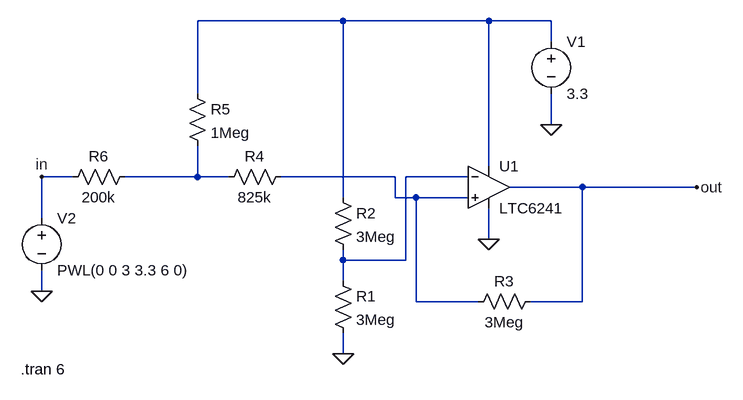
[diagram p0: schematic ENDDET.asc]
ENDDET.asc, the LTspice schematic file:
Version 4
SHEET 1 880 680
WIRE -96 -80 -320 -80
WIRE 128 -80 -96 -80
WIRE 224 -80 128 -80
WIRE 224 -48 224 -80
WIRE -320 32 -320 -80
WIRE 224 80 224 32
WIRE 128 144 128 -80
WIRE -512 160 -560 160
WIRE -320 160 -320 112
WIRE -320 160 -432 160
WIRE -272 160 -320 160
WIRE -16 160 -192 160
WIRE 96 160 0 160
WIRE 272 176 160 176
WIRE 448 176 272 176
WIRE -96 192 -96 -80
WIRE -16 192 -16 160
WIRE 16 192 -16 192
WIRE 96 192 16 192
WIRE -560 224 -560 160
WIRE 128 256 128 208
WIRE -96 288 -96 272
WIRE 0 288 0 160
WIRE 0 288 -96 288
WIRE -96 320 -96 288
WIRE -560 336 -560 304
WIRE 16 352 16 192
WIRE 112 352 16 352
WIRE 272 352 272 176
WIRE 272 352 192 352
WIRE -96 432 -96 400
FLAG 128 256 0
FLAG 224 80 0
FLAG -96 432 0
FLAG -560 336 0
FLAG 448 176 out
FLAG -560 160 in
SYMBOL voltage 224 -64 R0
WINDOW 123 0 0 Left 0
WINDOW 39 0 0 Left 0
SYMATTR InstName V1
SYMATTR Value 3.3
SYMBOL res -112 304 R0
SYMATTR InstName R1
SYMATTR Value 3Meg
SYMBOL res -112 176 R0
SYMATTR InstName R2
SYMATTR Value 3Meg
SYMBOL res 208 336 R90
WINDOW 0 0 56 VBottom 2
WINDOW 3 32 56 VTop 2
SYMATTR InstName R3
SYMATTR Value 3Meg
SYMBOL res -176 144 R90
WINDOW 0 0 56 VBottom 2
WINDOW 3 32 56 VTop 2
SYMATTR InstName R4
SYMATTR Value 825k
SYMBOL voltage -560 208 R0
WINDOW 123 0 0 Left 0
WINDOW 39 0 0 Left 0
SYMATTR InstName V2
SYMATTR Value PWL(0 0 3 3.3 6 0)
SYMBOL res -336 16 R0
SYMATTR InstName R5
SYMATTR Value 1Meg
SYMBOL res -416 144 R90
WINDOW 0 0 56 VBottom 2
WINDOW 3 32 56 VTop 2
SYMATTR InstName R6
SYMATTR Value 200k
SYMBOL Opamps\\LTC6241 128 176 R0
SYMATTR InstName U1
TEXT -592 456 Left 2 !.tran 6

The netlist it stands for:
* ENDDET.asc
V1 N001 0 3.3
R1 N004 0 3Meg
R2 N001 N004 3Meg
R3 out N003 3Meg
R4 N003 N002 825k
V2 in 0 PWL(0 0 3 3.3 6 0)
R5 N001 N002 1Meg
R6 N002 in 200k
XU1 N003 N004 N001 0 out LTC6241  ; pins In+ In- V+ V- OUT
.tran 6
.lib LTC4.lib
.backanno
.end